# Altium schematic sheet TYPEC.SchDoc
size A4; SheetNumber: 5; SheetTotal: 5
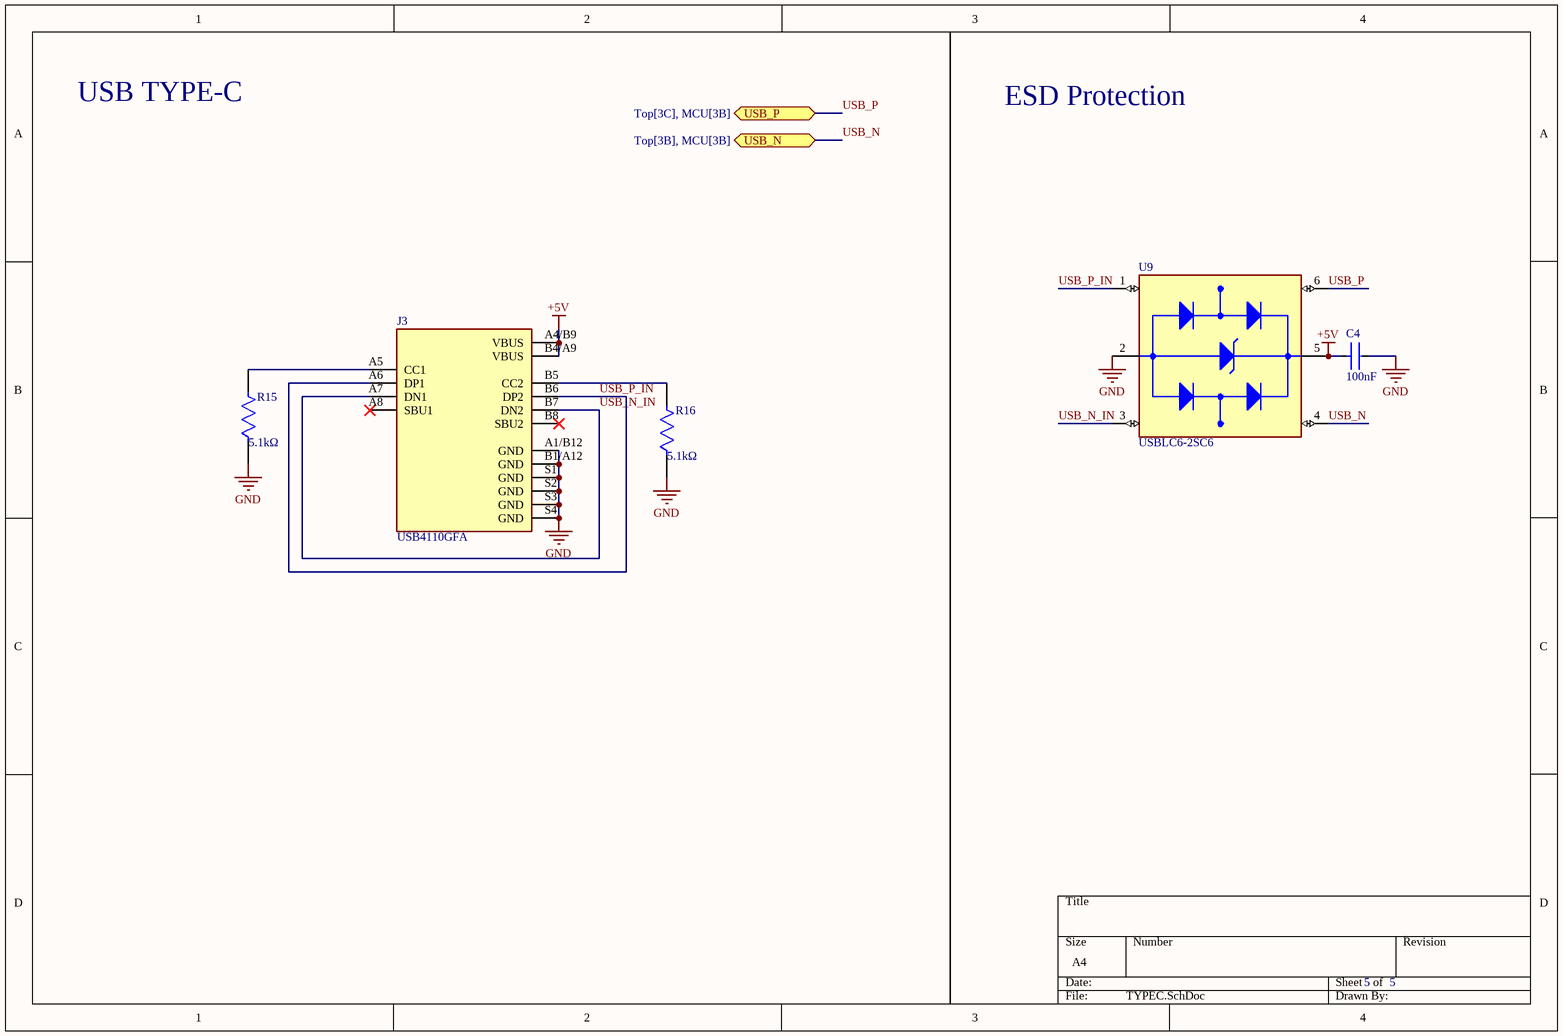
[diagram p0: TYPEC.SchDoc]

## Parts
C4  100nF  [0402_CAPACITOR]
J3  USB4110GFA  [GCT_USB4110GFA]
R15  value 5.1kΩ  [0402_RESISTOR]  (hidden comment: RESISTOR)
R16  value 5.1kΩ  [0603_RESISTOR]  (hidden comment: RESISTOR)
U9  USBLC6-2SC6  [SOT95P280X145-6N]

## Ports
USB_N (bidir, see Top[3B], MCU[3B]), USB_P (bidir, see Top[3C], MCU[3B])

## Nets
+5V: C4.1 J3.A4/B9(VBUS) J3.B4/A9(VBUS) U9.5(VBUS)
GND: C4.2 J3.A1/B12(GND) J3.B1/A12(GND) J3.S1(GND) J3.S2(GND) J3.S3(GND) J3.S4(GND) R15.1 R16.1 U9.2(GND)
USB_N: U9.4(I/O2_OUT) ; port USB_N
USB_N_IN: J3.A7(DN1) J3.B7(DN2) U9.3(I/O2_IN)
USB_P: U9.6(I/O1_OUT) ; port USB_P
USB_P_IN: J3.A6(DP1) J3.B6(DP2) U9.1(I/O1_IN)
NetJ3_A5: J3.A5(CC1) R15.2
NetJ3_B5: J3.B5(CC2) R16.2

Not connected (* = marked no-connect by the designer): J3 A8(SBU1)* B8(SBU2)*

## Notes on the sheet
- USB TYPE-C
- ESD Protection

## Library data of the parts
C4 = CMP-001-00091-1: Design Item ID: CAPACITOR; Source: gps_project_schematic_library.SchLib
J3 = USB4110GFA: USB-C (USB TYPE-C) USB 2.0 Receptacle Connector 24 (16+8 Dummy) Position Surface Mount, Right Angle; MF: Global Connector Technology; SnapEDA_Link: https://www.snapeda.com/parts/USB4110GFA/Global+Connector+Technology/view-part/?ref=snap; Package: None; Value: *; MP: USB4110GFA; Check_prices: https://www.snapeda.com/parts/USB4110GFA/Global+Connector+Technology/view-part/?ref=eda
U9 = USBLC6-2SC6: 17V Clamp 5A (8/20Âµs) Ipp Tvs Diode Surface Mount SOT-23-6; MF: STMicroelectronics; Value: *; SnapEDA_Link: https://www.snapeda.com/parts/USBLC6-2SC6/STMicroelectronics/view-part/?ref=snap; Check_prices: https://www.snapeda.com/parts/USBLC6-2SC6/STMicroelectronics/view-part/?ref=eda; Purchase-URL: https://pricing.snapeda.com/search/part/USBLC6-2SC6/?ref=eda; Price: None; Availability: In Stock; Package: SOT-23-6 STMicroelectronics; MP: USBLC6-2SC6